# EAGLE design BleSensor (EAGLE 7.5.0)
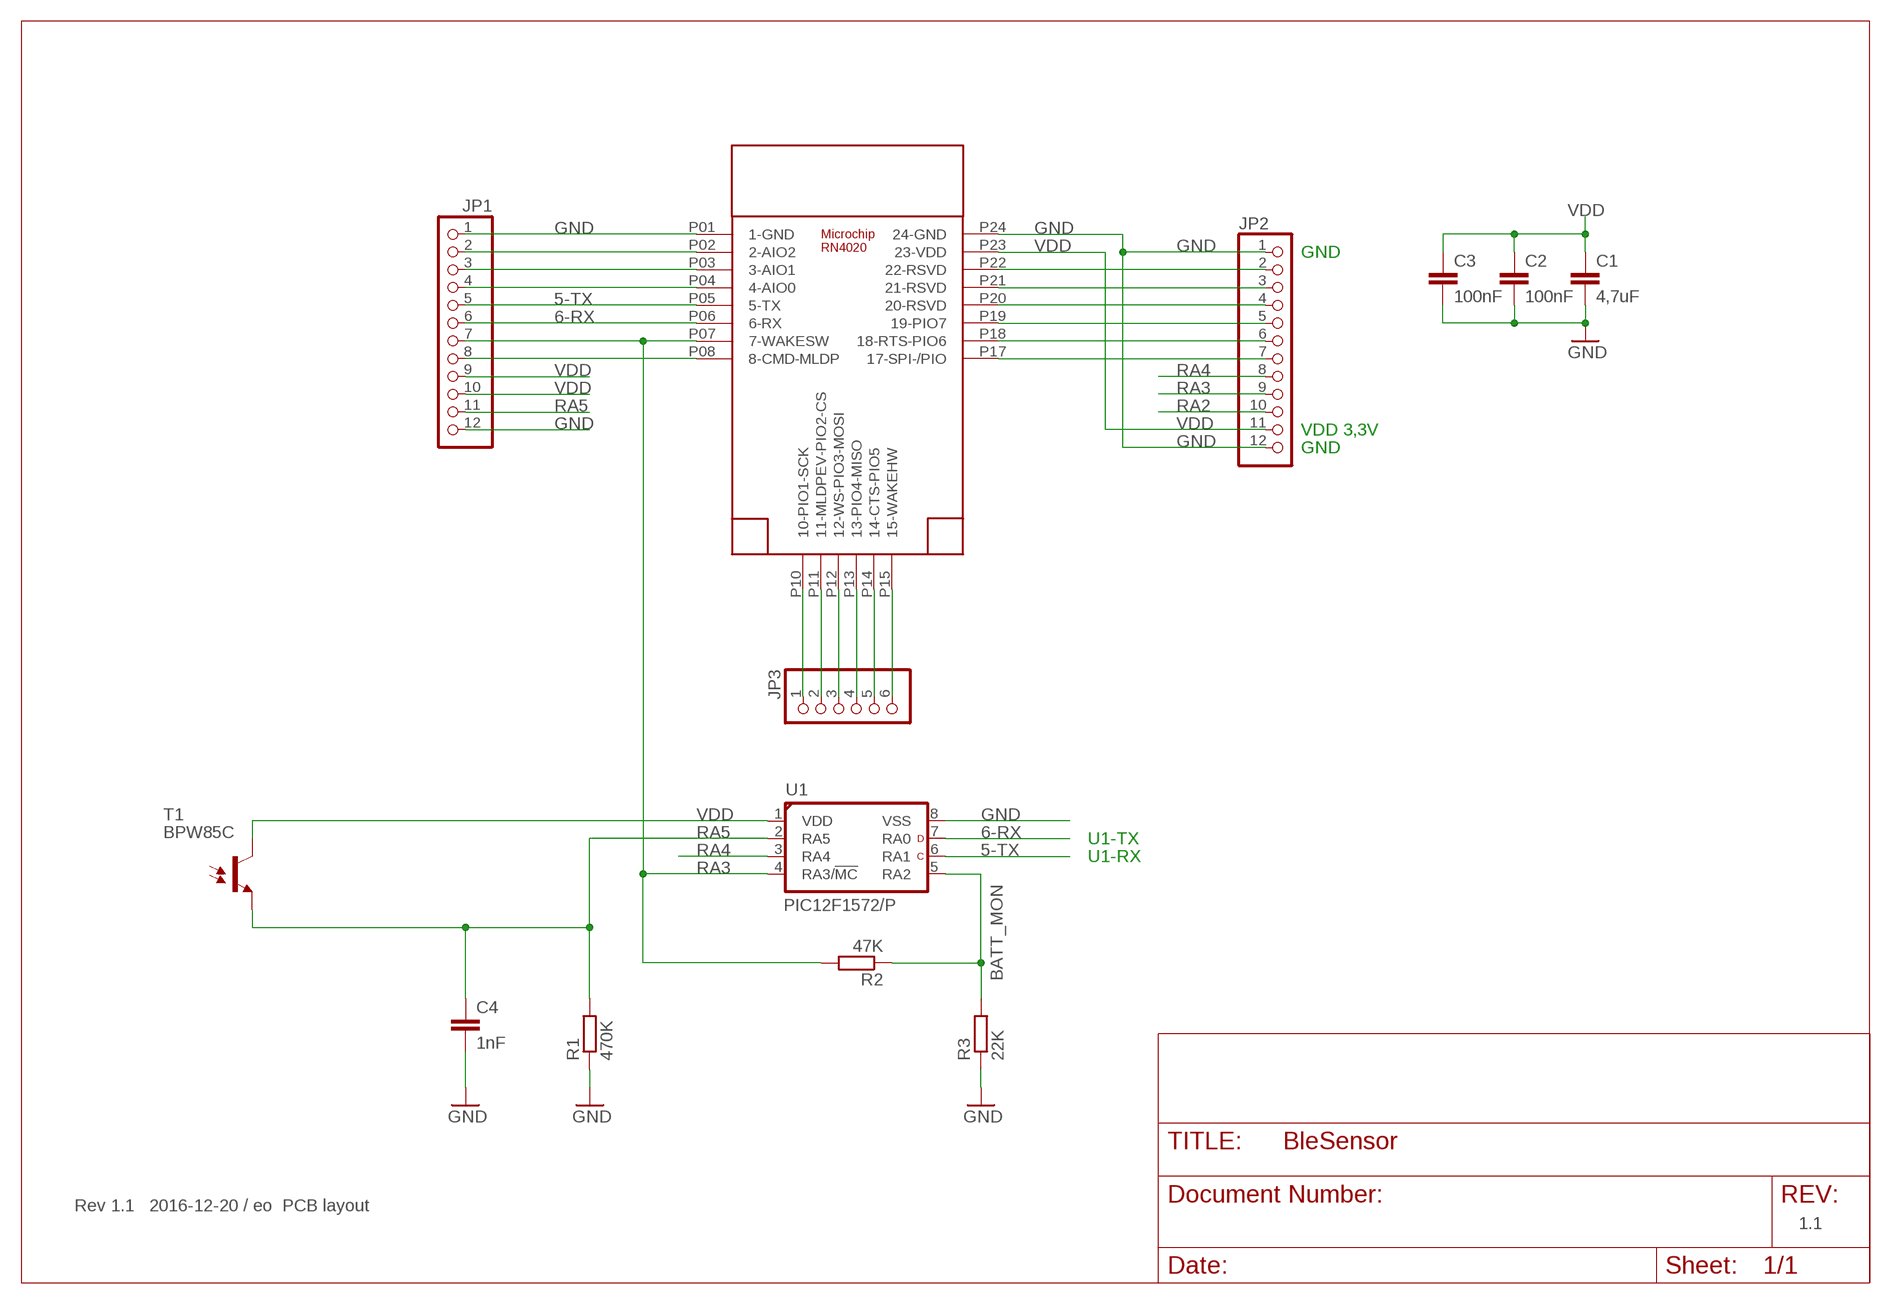
[diagram p0: schematic, sheet 1]

## Parts
C1  4,7uF  C2,5-3  [C2.5-3]
C2  100nF  C-EUC1206  [C1206]
C3  100nF  C-EUC1206  [C1206]
C4  1nF  C-EUC1206  [C1206]
JP1  PINHD-1X12  [1X12]
JP2  PINHD-1X12  [1X12]
JP3  PINHD-1X6  [1X06]
R1  470K  R-EU_M1206  [M1206]
R2  47K  R-EU_M1206  [M1206]
R3  22K  R-EU_M1206  [M1206]
T1  BPW85C  [LED3MM]
U1  PIC12F1572/P  [DIL8-P]
U$1  RN4020  [RN4020SMD]

## Nets
5-TX: JP1.5 U1.6(RA1) U$1.P05(5-TX)
6-RX: JP1.6 U1.7(RA0) U$1.P06(6-RX)
BATT_MON: R2.1 R3.2 U1.5(RA2)
GND: C1.2 C2.2 C3.2 C4.2 JP1.1 JP1.12 JP2.1 JP2.12 R1.1 R3.1 U1.8(VSS) U$1.P01(1-GND) U$1.P24(24-GND)
N$1: JP1.8 U$1.P08(8-CMD-MLDP)
N$4: JP2.2 U$1.P22(22-RSVD)
N$5: JP2.3 U$1.P21(21-RSVD)
N$6: JP2.4 U$1.P20(20-RSVD)
N$7: JP2.5 U$1.P19(19-PIO7)
N$8: JP2.6 U$1.P18(18-RTS-PIO6)
N$9: JP2.7 U$1.P17(17-SPI-/PIO)
N$10: JP1.2 U$1.P02(2-AIO2)
N$11: JP1.3 U$1.P03(3-AIO1)
N$12: JP1.4 U$1.P04(4-AIO0)
N$17: JP3.1 U$1.P10(10-PIO1-SCK)
N$18: JP3.2 U$1.P11(11-MLDPEV-PIO2-CS)
N$19: JP3.3 U$1.P12(12-WS-PIO3-MOSI)
N$20: JP3.4 U$1.P13(13-PIO4-MISO)
N$21: JP3.5 U$1.P14(14-CTS-PIO5)
N$22: JP3.6 U$1.P15(15-WAKEHW)
RA2: JP2.10
RA3: JP1.7 JP2.9 R2.2 U1.4(RA3/!MC!) U$1.P07(7-WAKESW)
RA4: JP2.8 U1.3(RA4)
RA5: C4.1 JP1.11 R1.2 T1.A(E) U1.2(RA5)
VDD: C1.1 C2.1 C3.1 JP1.9 JP1.10 JP2.11 T1.K(C) U1.1(VDD) U$1.P23(23-VDD)

## Notes on the sheet
- GND
- VDD 3,3V
- GND
- U1-TX
- U1-RX
- Rev 1.1   2016-12-20 / eo  PCB layout
- 1.1

## Library data of the parts
C1 = capacitor-wima:C: CAPACITOR naming: grid - package width
C2-C4 = rcl:C-EU: CAPACITOR, European symbol
JP1 JP2 = pinhead:PINHD-1X12: PIN HEADER
JP3 = pinhead:PINHD-1X6: PIN HEADER
R1-R3 = resistor:R-EU_: RESISTOR, European symbol
T1 = Vishay_tsal4400_bpw85c:BPW85C: BPW85C Hersteller Vishay Passender Sender: TSAL4400 TSAL4400 is a high efficiency infrared emitting diode in GaAlAs on GaAs technology, molded in clear, bluegrey tinted plastic packages. In comparison with the standard GaAs on GaAs technology these emitters achieve about 100 % radiant power improvement at a similar wavelength. The forward voltages at low current and at high pulse current roughly correspond to the low values of the standard technology. Therefore these emitters are ideally suitable as high performance replacements of standard emitters. Tipp: Gehause oft nicht angeschliffen: Emitter = Langer Pin
U1 = microchip_pic12f:PIC12*F1572: Low pincount microcontroller http://www.microchip.com/wwwproducts/Devices.aspx?product=PIC12F1572 Properties Parameter Name Value Program Memory Type Flash Program Memory (KB) 3.5 CPU Speed (MIPS) 8 RAM Bytes 256 Digital Communication Peripherals 1-UART, Capture/Compare/PWM Peripherals 3 Timers 2 x 8-bit, 4 x 16-bit ADC 4 ch, 10-bit Comparators 1 Temperature Range (C) -40 to 125 Operating Voltage Range (V) 1.8 to 5.5 Pin Count 8 Cap Touch Channels 4 Features Enhanced Mid-range Core with 49 Instruction, 16 Stack Levels Flash Program Memory with self read/write capability 128 Bytes of Non-Volatile Data Storage, High-Endurance Flash (HEF) Internal clock speeds from 31kHz to 32MHz 3x Standalone 16-bit PWMs Complementary Waveform Generator (CWG) 4 Channel 10-bit ADC with Voltage Reference 5-bit Digital to Analog Converter (DAC) Comparator 2x 8-bit Timers (TMR0/TMR2) 1x 16-bit Timer (TMR1) Three additional 16-bit Timers available using the 16-bit PWMs Extended Watchdog Timer (WDT) Enhanced Power-On/Off-Reset Low-Power Brown-Out Reset (LPBOR) Programmable Brown-Out Reset (BOR) In Circuit Serial Programming (ICSP) PIC12LF1572 (1.8V – 3.6V) PIC12F1572 (2.3V – 5.5V) Library from www.mikroelektroniikka.fi/lbr
U$1 = microchip_bluetooth_v101_esanblesensor:RN4020

## Board
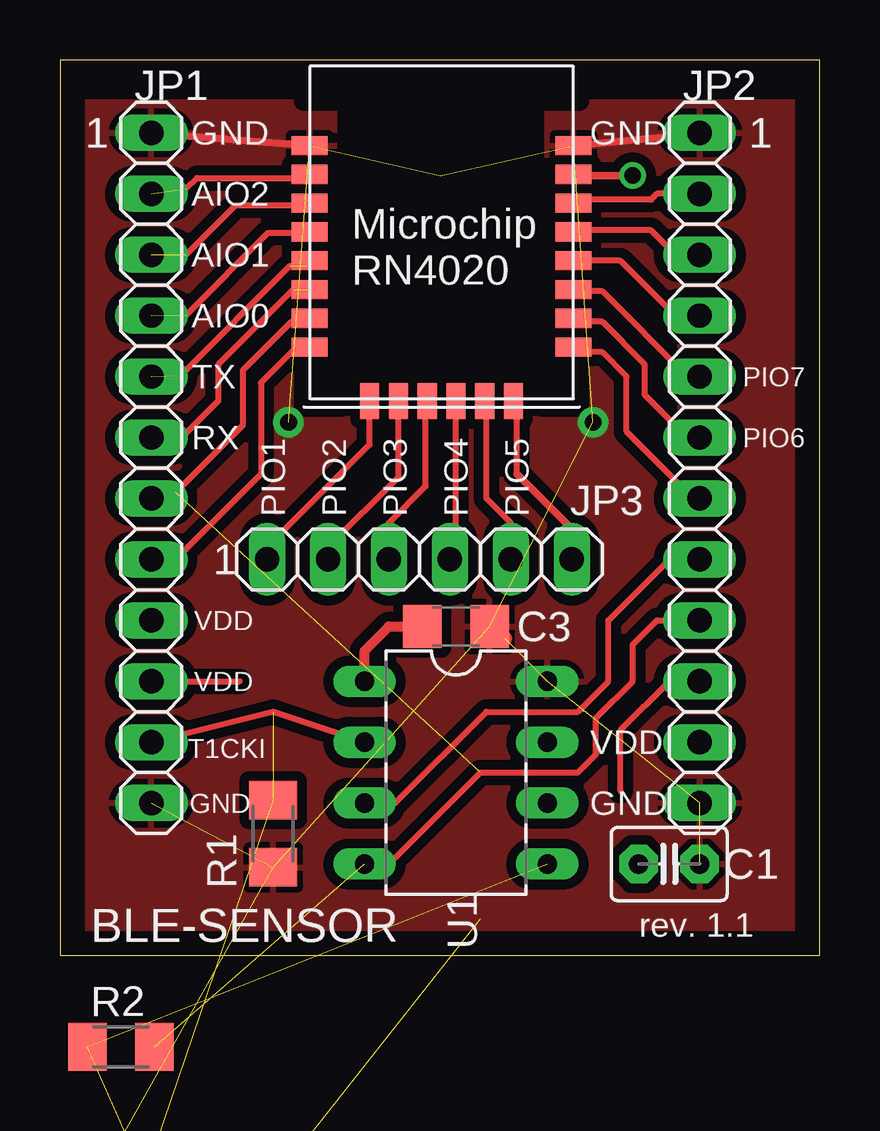
[diagram p1: board, top side]
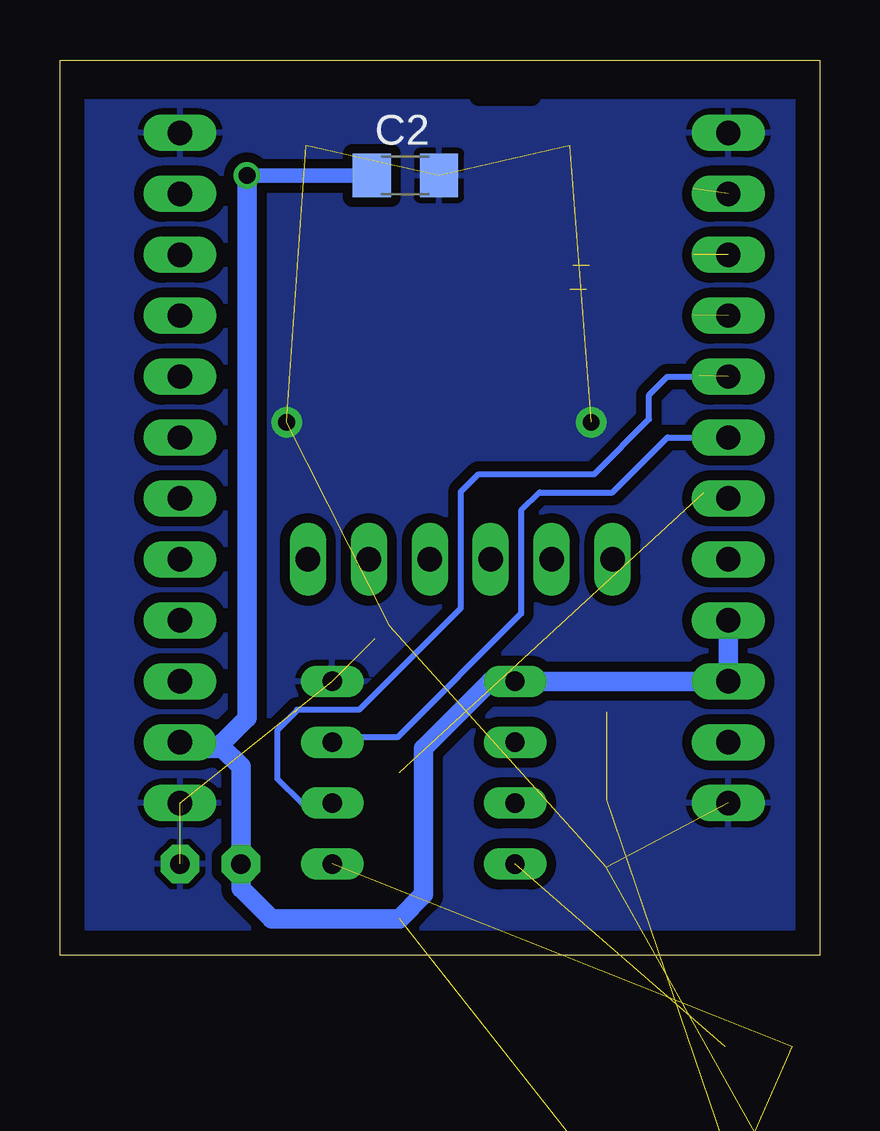
[diagram p2: board, bottom side, seen from below]

Size 31.67 x 37.33 mm. Coordinates in mm from the lower left corner, seen from the top.
Outline: 0,0 31.67,0 31.67,37.33 0,37.33 0,0
Copper layers (1*16): Top 0.035mm / dielectric 1.5mm / Bottom 0.035mm
Design rules "default": minimum track width 10mil, minimum drill 24mil, track to track 8mil, track to pad 8mil, pad to pad 8mil, via to via 8mil, smd to smd 8mil, copper to edge 40mil, drill to drill 8mil, minimum pad ring 10mil, minimum via ring 8mil, stop-mask expansion 4mil, vias tented up to drill 0mil, thermal gap 10mil

### Footprints (pad centres in the part's own frame; a part is rotated, then mirrored left to right if it is on the bottom)
C2.5-3 = drill 0.813 pad 1.6 octagon: 1 -1.27,0; 2 1.27,0
C1206 = smd 1.6 x 1.8: 1 -1.4,0; 2 1.4,0
1X12 = drill 1.016 long: 1 -13.97,0; 2 -11.43,0; 3 -8.89,0; 4 -6.35,0; 5 -3.81,0; 6 -1.27,0; 7 1.27,0; 8 3.81,0; 9 6.35,0; 10 8.89,0; 11 11.43,0; 12 13.97,0
1X06 = drill 1.016 long: 1 -6.35,0; 2 -3.81,0; 3 -1.27,0; 4 1.27,0; 5 3.81,0; 6 6.35,0
M1206 = smd 1.6 x 2: 1 -1.4,0; 2 1.4,0
LED3MM = drill 0.813 octagon: A -1.27,0; K 1.27,0
DIL8-P = drill 0.8 pad 1.3 long: 1 -3.81,-3.81; 2 -1.27,-3.81; 3 1.27,-3.81; 4 3.81,-3.81; 5 3.81,3.81; 6 1.27,3.81; 7 -1.27,3.81; 8 -3.81,3.81
RN4020SMD = smd 1.5 x 0.8: P01 0.25,10.9; P02 0.25,9.7; P03 0.25,8.5; P04 0.25,7.3; P05 0.25,6.1; P06 0.25,4.9; P07 0.25,3.7; P08 0.25,2.5; P17 11.25,2.5; P18 11.25,3.7; P19 11.25,4.9; P20 11.25,6.1; P21 11.25,7.3; P22 11.25,8.5; P23 11.25,9.7; P24 11.25,10.9 | smd 0.8 x 1.5: P10 2.75,0.25; P11 3.95,0.25; P12 5.15,0.25; P13 6.35,0.25; P14 7.55,0.25; P15 8.75,0.25

### Placement (x,y rotation side)
C1  25.4,3.81 0 top
C2  17.27,32.51 0 bottom
C3  16.51,13.72 0 top
C4  2.54,-21.59 0 top  (outside the outline)
JP1  3.81,20.32 270 top
JP2  26.67,20.32 270 top
JP3  14.99,16.51 0 top
R1  8.89,5.08 90 top
R2  2.54,-3.81 0 top  (outside the outline)
R3  2.54,-10.16 0 top  (outside the outline)
T1  2.54,-15.88 0 top  (outside the outline)
U1  16.51,7.62 270 top
U$1  10.16,22.86 0 top

### Tracks (layer width: path | path; a pad name or v marks a point on that pad's centre or on a via)
5-TX  (3 unrouted)
  Top 0.254: 5.03,24.18 9.6,28.75 | 10.29,28.75 U$1.P05
  Bottom 0.254: 21.79,10.24 19.2,10.24 14.96,14.48 14.96,19.33 14.22,20.07 9.4,20.07 7.11,22.35 7.11,23.37 6.35,24.13 JP1.5 | U1.6 21.59,6.35 22.61,7.37 22.61,9.4 21.84,10.16
6-RX  (1 unrouted)
  Top 0.254: 9.73,27.76 6.6,24.64 6.6,23.11 5.08,21.59 JP1.6
  Bottom 0.254: U1.7 20.12,9.09 17.6,9.09 12.45,14.25 12.45,18.54 11.68,19.3 8.64,19.3 6.35,21.59 JP1.6
BATT_MON  (2 unrouted)
GND  (via drill 0.7 pad 1.27)  (12 unrouted)
  Top 0.305: JP2.1 27.12,34.29 U$1.P24 | JP1.1 3.5,34.29 U$1.P01
  Top 0.61: C3.2 18.54,13.21
  other vias: 9.53,22.23 22.23,22.23
  pour Bottom (isolate 0.406): 0,0 0,35.56 31.75,35.56 31.75,0
  pour Top (isolate 0.406): 0,35.56 11.43,35.56 11.43,24.13 20.32,24.13 20.32,35.56 31.75,35.56 31.75,0 0,0
N$1
  Top 0.254: U$1.P08 9.87,25.36 8.38,23.88 8.38,20.07 4.83,16.51 JP1.8
N$4
  Top 0.254: JP2.2 24.89,31.75 24.64,31.5 21.55,31.5 U$1.P22
N$5
  Top 0.254: JP2.3 25.65,29.21 24.64,30.23 21.48,30.23 U$1.P21
N$6
  Top 0.254: JP2.4 25.65,26.67 23.37,28.96 U$1.P20
N$7
  Top 0.254: JP2.5 26.16,24.13 22.61,27.69 21.48,27.69 U$1.P19
N$8
  Top 0.254: JP2.6 26.16,21.59 24.38,23.37 24.38,24.64 22.61,26.42 21.55,26.42 U$1.P18
N$9
  Top 0.254: JP2.7 26.42,19.05 23.62,21.84 23.62,24.13 22.61,25.15 21.62,25.15 U$1.P17
N$10  (1 unrouted)
  Top 0.254: 5.26,31.95 5.71,32.41 10.29,32.41 U$1.P02
N$11  (1 unrouted)
  Top 0.254: 5.26,29.21 7.32,31.27 10.29,31.27 U$1.P03
N$12  (1 unrouted)
  Top 0.254: 5.26,26.7 8.69,30.12 10.29,30.12 U$1.P04
N$17
  Top 0.254: JP3.1 8.64,17.02 12.91,21.29 U$1.P10
N$18
  Top 0.254: 13.95,23.04 U$1.P11 14.11,19.95 11.18,17.02 JP3.2
N$19
  Top 0.254: 15.32,23.04 U$1.P12 15.24,23.04 15.24,19.56 13.72,18.03 JP3.3
N$20
  Top 0.254: JP3.4 16.51,16.76 U$1.P13
N$21
  Top 0.254: JP3.5 18.8,18.03 17.78,19.05 17.78,23.04 U$1.P14
N$22
  Top 0.254: JP3.6 21.34,17.78 | 19.05,20.07 19.05,22.97 U$1.P15
  Top 0.305: 19.05,20.07 21.34,17.78
RA2
  Top 0.254: 23.37,6.86 23.37,9.4 25.4,11.43 JP2.10
RA3  (2 unrouted)
  Top 0.254: U1.4 13.72,3.81 17.53,7.62 21.59,7.62 22.35,8.38 22.35,9.91 23.88,11.43 23.88,12.95 24.89,13.97 JP2.9 | U$1.P07 10.41,26.41 9.65,26.41 7.62,24.38 7.62,22.1 4.83,19.3 4.06,19.3 JP1.7
RA4
  Top 0.254: U1.3 13.97,6.35 17.78,10.16 21.59,10.16 22.86,11.43 22.86,13.97 25.4,16.51 JP2.8
RA5  (3 unrouted)
  Top 0.254: JP1.11 8.89,10.16 U1.2
VDD  (via drill 0.7)  (1 unrouted)
  Top 0.254: JP1.10 7.49,11.43
  Top 0.305: v23.88,32.51 21.46,32.51
  Top 0.406: U1.1 12.7,12.7 13.72,13.72 C3.1 | 21.46,32.51 U$1.P23
  Bottom 0.254: 26.42,8.64 JP2.11
  Bottom 0.406: 24.89,8.89 JP2.11
  Bottom 0.61: v23.88,32.51 C2.1
  Bottom 0.813: JP1.9 JP1.10 U1.1 13.72,11.43 16.51,8.64 16.51,2.54 17.53,1.52 22.86,1.52 24.13,2.79 C1.1 24.13,7.87 24.89,8.64 26.42,8.64 | v23.88,32.51 23.88,9.91 24.89,8.89

### Text on the board
tPlace: 1 | 1 | 1
tNames: GND | GND | AIO2 | AIO1 | AIO0 | TX | PIO7 | RX | PIO6 | PIO1 | PIO2 | PIO3 | PIO4 | PIO5 | VDD | VDD | T1CKI | VDD | GND | GND | BLE-SENSOR | rev. 1.1